# EasyEDA Pro project ProPrj_STM32G474RET6_2026-01-30.epro, board PCB4
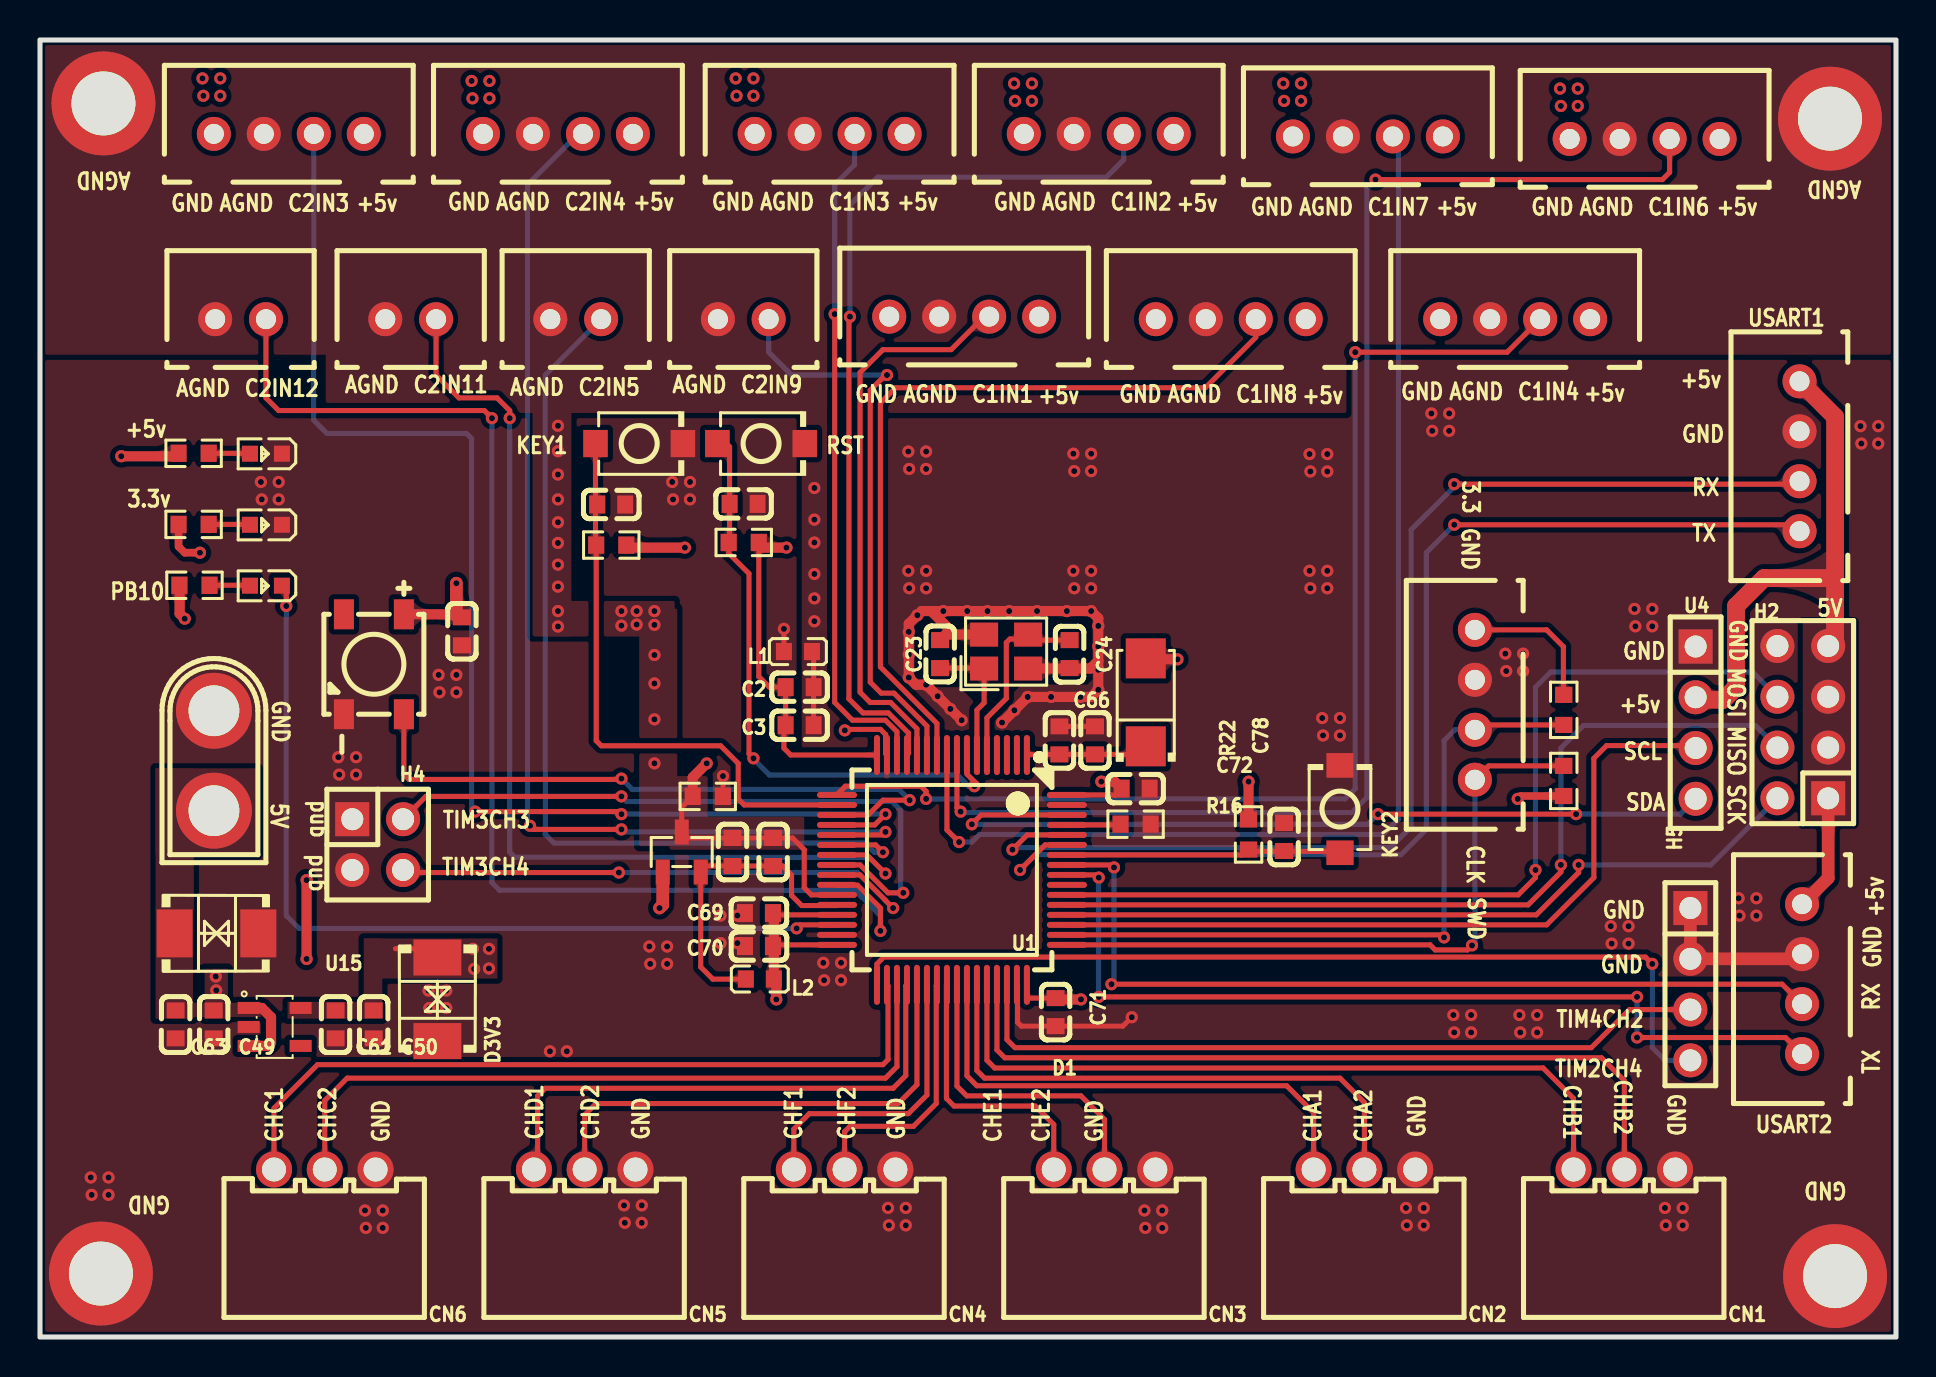
[diagram p4: board, top side]
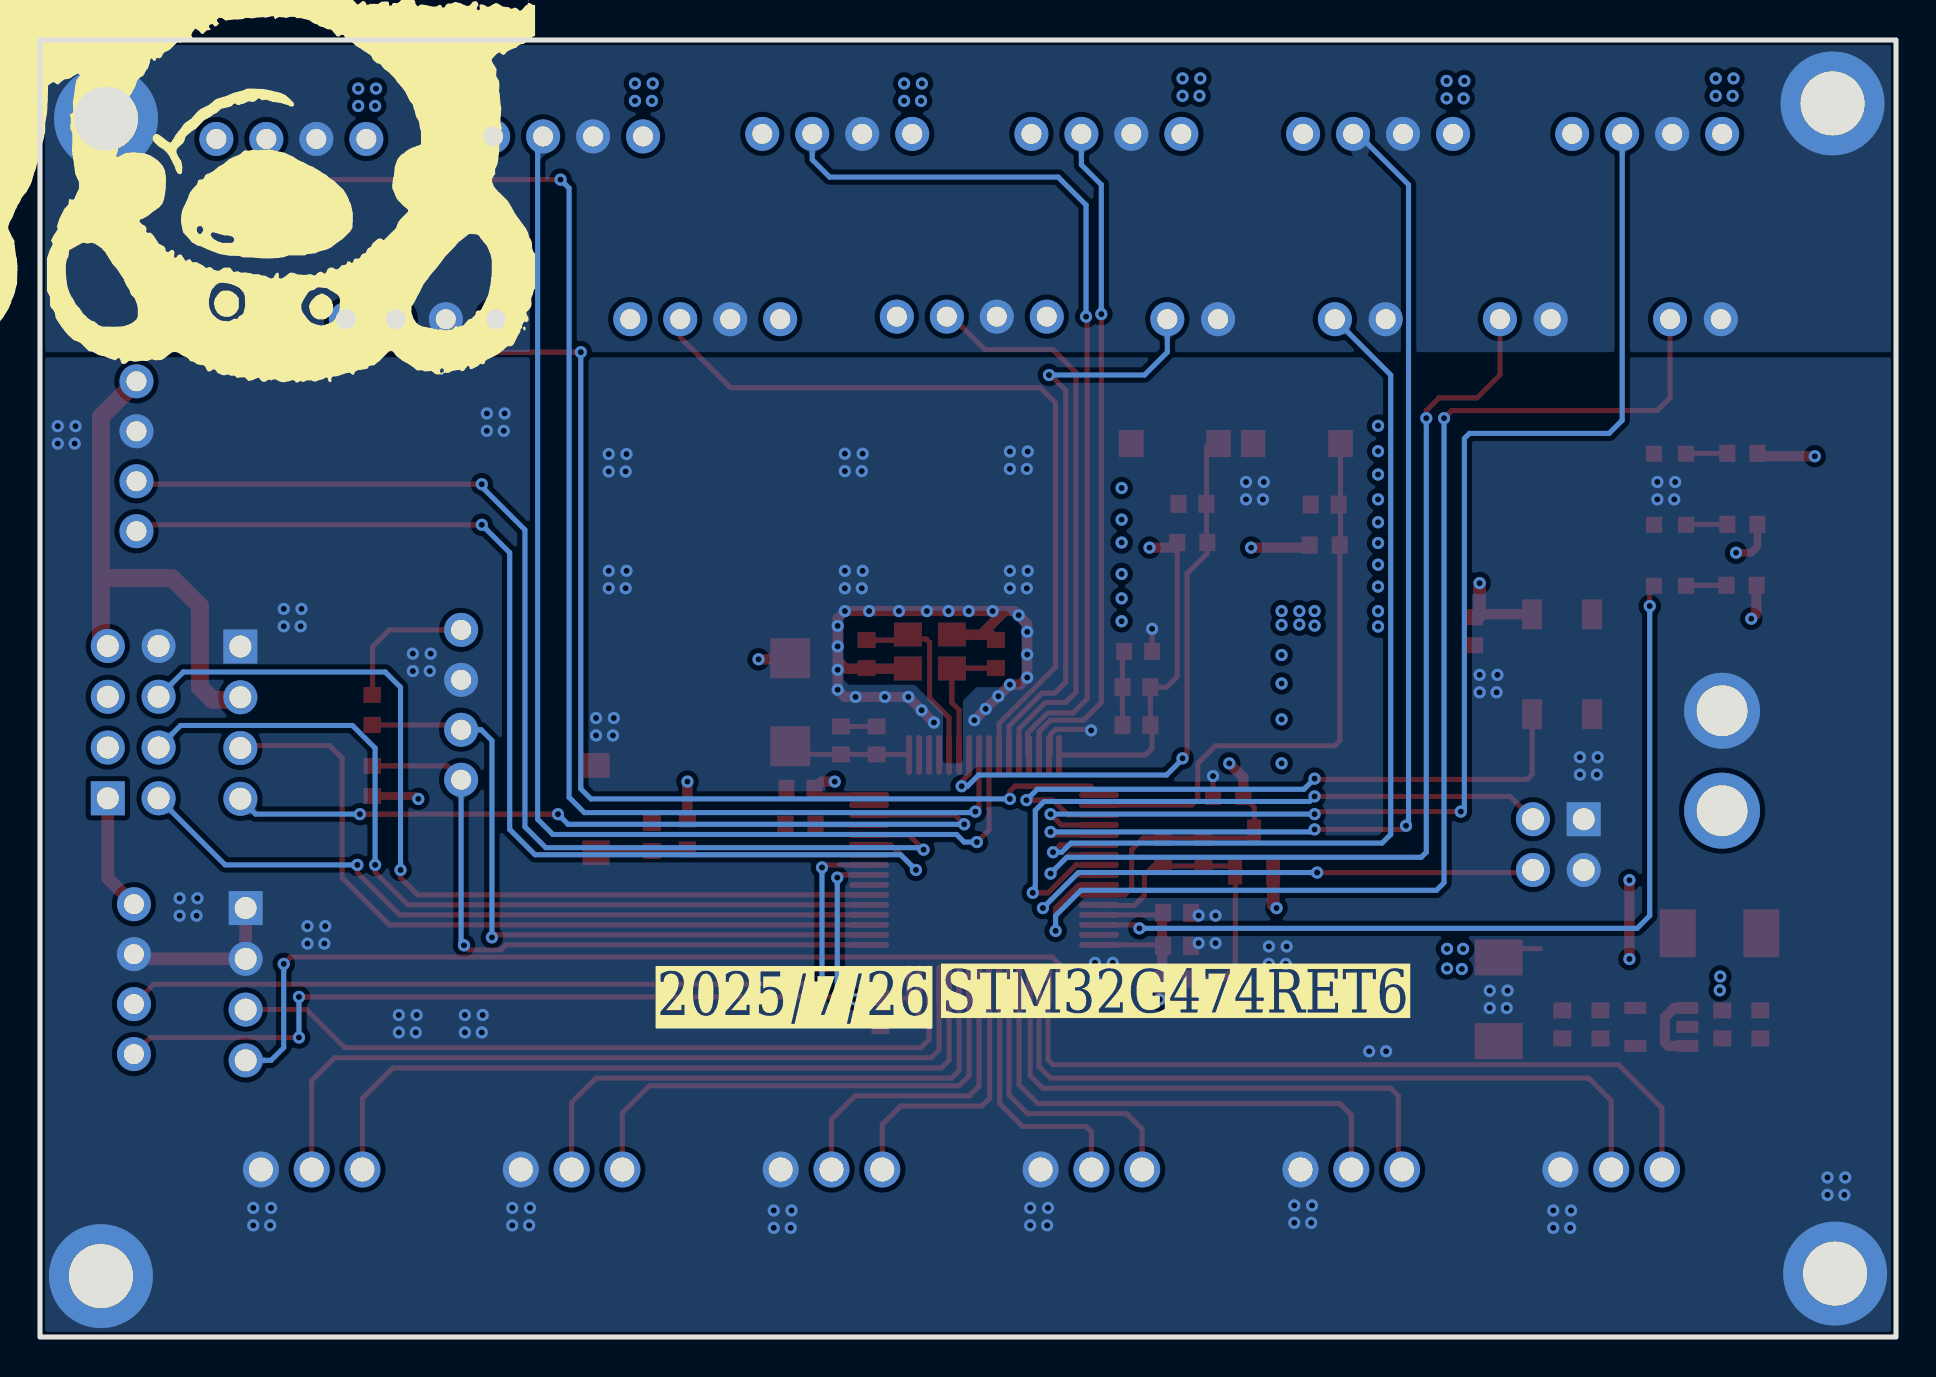
[diagram p5: board, bottom side, seen from below]

Outline 92.84 x 64.9 mm; copper layers: Top Layer, Inner1, Inner2, Bottom Layer. Coordinates in mm from the lower left corner of the outline.
Outline path: rectangle 0,64.9 92.84,0
Stack: Top Layer 0.035mm 外层铜厚1oz / Dielectric1 0.2104mm 7628 RC49% 8.6mil / Inner1 0.0152mm 内层铜厚 / Dielectric2 1.065mm 1.1mm H/HOZ Copper / Inner2 0.0152mm 内层铜厚 / Dielectric3 0.2104mm 7628 RC49% 8.6mil / Bottom Layer 0.035mm 外层铜厚1oz

## Design rules (mm)
template: 自定义配置
spacing copperThickness1oz (default): track to track 0.102, other pairs 0.152 to 0.3
spacing copperThickness2oz: track to track 0.203, other pairs 0.152 to 0.3
track width copperThickness1oz (default): min 0.127, default 0.254, max 2.54
track width copperThickness2oz: min 0.203, default 0.254, max 2.54
differential pair differentialPair (default): width min 0.127, default 0.254, max 2.54; gap min 0.152, default 0.152
via viaSize (default): diameter min 0.5, default 0.61, max 10; hole min 0.3, default 0.305, max 6.3

## Placement (name value [footprint] x y rotation side)
C2  10uF  [C0603]  37.99 32.52 180 top
C3  100nF  [C0603]  37.99 30.61 180 top
C23  12pF  [C0603]  45.02 34.17 270 top
C24  12pF  [C0603]  51.5 34.17 90 top
C44  100nF  [C0603]  21.1 35.31 270 top
C49  100nF  [C0603]  8.69 15.64 90 top
C50  100nF  [C0603]  16.69 15.64 90 top
C61  1uF  [C0603]  14.79 15.64 90 top
C63  1uF  [C0603]  6.79 15.64 90 top
C65  100nF  [C0603]  50.99 29.85 270 top
C66  100nF  [C0603]  52.77 29.85 270 top
C69  100nF  [C0603]  35.96 21.21 0 top
C70  100nF  [C0603]  35.96 19.56 0 top
C71  100nF  [C0603]  50.8 16.26 90 top
C72  100nF  [C0603]  54.8 27.44 180 top
C73  1uF  [C0603]  36.67 24.27 270 top
C74  10nF  [C0603]  34.64 24.27 270 top
C78  100nF  [C0603]  62.23 25.02 270 top
C80  100nF  [C0603]  35.19 41.69 180 top
C81  100nF  [C0603]  28.58 41.66 180 top
CN1  XH-3AW  [CONN-TH_3P-P2.54_HCTL_XH-3AW]  79.25 8.38 180 top
CN2  XH-3AW  [CONN-TH_3P-P2.54_HCTL_XH-3AW]  66.25 8.38 180 top
CN3  XH-3AW  [CONN-TH_3P-P2.54_HCTL_XH-3AW]  53.25 8.38 180 top
CN4  XH-3AW  [CONN-TH_3P-P2.54_HCTL_XH-3AW]  40.25 8.38 180 top
CN5  XH-3AW  [CONN-TH_3P-P2.54_HCTL_XH-3AW]  27.25 8.38 180 top
CN6  XH-3AW  [CONN-TH_3P-P2.54_HCTL_XH-3AW]  14.25 8.38 180 top
CN8  XT30U-M  [CONN-TH_XT30U-M]  8.7 28.83 90 top
CN11  B2B-XH-A(LF)(SN)  [CONN-TH_B2B-XH-A-LF-SN]  26.8 50.93 0 top
CN12  B2B-XH-A(LF)(SN)  [CONN-TH_B2B-XH-A-LF-SN]  35.18 50.93 0 top
CN13  B2B-XH-A(LF)(SN)  [CONN-TH_B2B-XH-A-LF-SN]  18.54 50.93 0 top
CN14  B2B-XH-A(LF)(SN)  [CONN-TH_B2B-XH-A-LF-SN]  10.03 50.93 0 top
D1  SS34-A  [SMA_L4.3-W2.6-LS5.2-RD]  55.31 31.76 90 top
D3V3  SMBJ3.3CA  [SMB_L4.6-W3.5-LS5.3-BI]  19.88 16.9 90 top
D3V4  SMBJ3.3CA  [SMB_L4.6-W3.5-LS5.3-BI]  8.83 20.2 180 top
H2  PZ254V-12-8P  [HDR-TH_8P-P2.54-V-M-R2-C4-S2.54]  88.17 30.76 90 top
H4  PZ254V-12-4P  [HDR-TH_4P-P2.54-V-M-R2-C2-S2.54]  16.89 24.64 270 top
H5  PZ254V-11-04P  [HDR-TH_4P-P2.54-V-M]  82.55 17.65 270 top
KEY2  SKRKAEE020  [SW-SMD_L3.9-W3.0-P4.45]  65.02 26.42 90 top
KEY3  SKRKAEE020  [SW-SMD_L3.9-W3.0-P4.45]  29.97 44.7 0 top
L1  BLM18PG121SN1D  [L0603]  37.91 34.3 0 top
L2  BLM18PG121SN1D  [L0603]  36.01 17.91 180 top
LED3  XL-5050RGBC-WS2812B  [LED-SMD_4P-L5.0-W5.0-BL_XL-5050RGBC]  16.7 33.66 180 top
LED4  LTST-C190YKT  [LED0603-RD]  11.3 40.64 180 top
LED5  LTST-C190YKT  [LED0603-RD]  11.3 44.2 180 top
LED6  LTST-C190YKT  [LED0603-RD]  11.3 37.59 180 top
NOREF  -  [Pad_e5011]  89.79 3.05 0 top
NOREF#2  -  [Pad_e5012]  3.05 3.17 0 top
NOREF#3  -  [Pad_e5014]  89.53 60.96 0 top
NOREF#4  -  [Pad_e5013]  3.17 61.72 0 top
R16  10kΩ  [R0603]  54.8 25.66 0 top
R17  1kΩ  [R0603]  7.68 40.66 0 top
R18  1kΩ  [R0603]  7.73 37.61 0 top
R19  5kΩ  [R0603]  7.68 44.22 0 top
R20  1kΩ  [R0603]  35.2 39.75 180 top
R22  1kΩ  [R0603]  60.45 25.15 270 top
R24  0Ω  [R0603]  33.4 27.05 180 top
R87  3.3kΩ  [R0603]  76.22 27.82 270 top
R88  3.3kΩ  [R0603]  76.22 31.38 90 top
R89  1kΩ  [R0603]  28.58 39.62 180 top
SW1  SKRKAEE020  [SW-SMD_L3.9-W3.0-P4.45]  36.07 44.7 0 top
U1  STM32G474RET6  [LQFP-64_L10.0-W10.0-P0.50-LS12.0-BL]  45.61 23.37 180 top
U4  HC-PZ254-11.5L-1x4PZ  [HDR-TH_4P-P2.54-V-M-4]  82.81 30.74 270 top
U15  LP5907MFX-3.3  [SOT-23-5_L3.0-W1.7-P0.95-LS2.8-BR]  11.74 15.52 180 top
U16  REF3033AIDBZRQ1  [SOT-23-3_L2.9-W1.3-P1.90-LS2.4-BR]  32.1 24.27 270 top
U24  B4B-XH-A(LF)(SN)  [CONN-TH_B4B-XH-A-LF-SN]  46.23 51.05 0 top
U25  B4B-XH-A(LF)(SN)  [CONN-TH_B4B-XH-A-LF-SN]  52.96 60.2 0 top
U26  B4B-XH-A(LF)(SN)  [CONN-TH_B4B-XH-A-LF-SN]  39.5 60.2 0 top
U27  B4B-XH-A(LF)(SN)  [CONN-TH_B4B-XH-A-LF-SN]  73.79 50.93 0 top
U28  B4B-XH-A(LF)(SN)  [CONN-TH_B4B-XH-A-LF-SN]  80.26 59.94 0 top
U29  B4B-XH-A(LF)(SN)  [CONN-TH_B4B-XH-A-LF-SN]  66.42 60.07 0 top
U30  B4B-XH-A(LF)(SN)  [CONN-TH_B4B-XH-A-LF-SN]  59.56 50.93 0 top
U31  B4B-XH-A(LF)(SN)  [CONN-TH_B4B-XH-A-LF-SN]  12.45 60.2 0 top
U32  B4B-XH-A(LF)(SN)  [CONN-TH_B4B-XH-A-LF-SN]  25.91 60.2 0 top
U34  B4B-XH-A(LF)(SN)  [CONN-TH_B4B-XH-A-LF-SN]  71.77 31.63 90 top
U35  B4B-XH-A(LF)(SN)  [CONN-TH_B4B-XH-A-LF-SN]  88.14 17.91 90 top
U36  B4B-XH-A(LF)(SN)  [CONN-TH_B4B-XH-A-LF-SN]  88.01 44.07 90 top
X1  12MHz  [CRYSTAL-SMD_4P-L3.2-W2.5-BL]  48.33 34.3 0 top

## Footprints (pads in the part's own frame, mm; a bottom-side part is the same pattern mirrored in y, then rotated)
C0603
  rect 0.8x0.9 smd: 1(-0.7,0) 2(0.7,0)
CONN-TH_3P-P2.54_HCTL_XH-3AW
  round 1.8 hole 1.199: 1(-2.54,0) 2(0.002,0) 3(2.54,0)
CONN-TH_B2B-XH-A-LF-SN
  round 1.7 hole 1: 1(1.27,0) 2(-1.27,0)
CONN-TH_B4B-XH-A-LF-SN
  round 1.7 hole 1: 1(3.75,0) 2(1.25,0) 3(-1.25,0) 4(-3.75,0)
CONN-TH_XT30U-M
  round 3.8 hole 2.54: 1(-2.5,0) 2(2.5,0)
CRYSTAL-SMD_4P-L3.2-W2.5-BL
  rect 1.4x1.2 smd: 1(-1.1,-0.85) 2(1.1,-0.85) 3(1.1,0.85) 4(-1.1,0.85)
HDR-TH_4P-P2.54-V-M
  rect 1.7x1.7 hole 1.1: 1(-3.81,0)
  round 1.7 hole 1.1: 2(-1.27,0) 3(1.27,0) 4(3.81,0)
HDR-TH_4P-P2.54-V-M-4
  rect 1.7x1.7 hole 1.1: 1(-3.81,0)
  round 1.7 hole 1.1: 2(-1.27,0) 3(1.27,0) 4(3.81,0)
HDR-TH_4P-P2.54-V-M-R2-C2-S2.54
  rect 1.7x1.7 hole 1.1: 1(-1.27,-1.27)
  round 1.7 hole 1.1: 2(-1.27,1.27) 3(1.27,-1.27) 4(1.27,1.27)
HDR-TH_8P-P2.54-V-M-R2-C4-S2.54
  rect 1.7x1.7 hole 1.1: 1(-3.81,-1.27)
  round 1.7 hole 1.1: 2(-3.81,1.27) 3(-1.27,-1.27) 4(-1.27,1.27) 5(1.27,-1.27) 6(1.27,1.27) 7(3.81,-1.27) 8(3.81,1.27)
L0603
  rect 0.8x0.864 smd: 1(-0.7,0) 2(0.7,0)
LED0603-RD
  rect 0.8x0.8 smd: 1(-0.799,0) 2(0.799,0)
LED-SMD_4P-L5.0-W5.0-BL_XL-5050RGBC
  rect 1x1.5 smd: 1(-1.5,-2.5) 2(1.5,-2.5) 3(1.5,2.5) 4(-1.5,2.5)
LQFP-64_L10.0-W10.0-P0.50-LS12.0-BL
  oval 0.3x2 smd: 1(-3.75,-5.75) 2(-3.25,-5.75) 3(-2.75,-5.75) 4(-2.25,-5.75) 5(-1.75,-5.75) 6(-1.25,-5.75) 7(-0.75,-5.75) 8(-0.25,-5.75) 9(0.25,-5.75) 10(0.75,-5.75) 11(1.25,-5.75) 12(1.75,-5.75) 13(2.25,-5.75) 14(2.75,-5.75) 15(3.25,-5.75) 16(3.75,-5.75) 33(3.75,5.75) 34(3.25,5.75) 35(2.75,5.75) 36(2.25,5.75) 37(1.75,5.75) 38(1.25,5.75) 39(0.75,5.75) 40(0.25,5.75) 41(-0.25,5.75) 42(-0.75,5.75) 43(-1.25,5.75) 44(-1.75,5.75) 45(-2.25,5.75) 46(-2.75,5.75) 47(-3.25,5.75) 48(-3.75,5.75)
  oval 2x0.3 smd: 17(5.75,-3.75) 18(5.75,-3.25) 19(5.75,-2.75) 20(5.75,-2.25) 21(5.75,-1.75) 22(5.75,-1.25) 23(5.75,-0.75) 24(5.75,-0.25) 25(5.75,0.25) 26(5.75,0.75) 27(5.75,1.25) 28(5.75,1.75) 29(5.75,2.25) 30(5.75,2.75) 31(5.75,3.25) 32(5.75,3.75) 49(-5.75,3.75) 50(-5.75,3.25) 51(-5.75,2.75) 52(-5.75,2.25) 53(-5.75,1.75) 54(-5.75,1.25) 55(-5.75,0.75) 56(-5.75,0.25) 57(-5.75,-0.25) 58(-5.75,-0.75) 59(-5.75,-1.25) 60(-5.75,-1.75) 61(-5.75,-2.25) 62(-5.75,-2.75) 63(-5.75,-3.25) 64(-5.75,-3.75)
Pad_e5011
  round 5.2 hole 3.2: 1(0,0)
Pad_e5012
  round 5.2 hole 3.2: 1(0,0)
Pad_e5013
  round 5.2 hole 3.2: 1(0,0)
Pad_e5014
  round 5.2 hole 3.2: 1(0,0)
R0603
  rect 0.806x0.864 smd: 1(-0.753,0) 2(0.753,0)
SMA_L4.3-W2.6-LS5.2-RD
  rect 2x2 smd: 1(-2.2,0) 2(2.2,0)
SMB_L4.6-W3.5-LS5.3-BI
  rect 1.8x2.4 smd: 1(-2.091,0) 2(2.091,0)
SOT-23-3_L2.9-W1.3-P1.90-LS2.4-BR
  rect 1.25x0.7 smd: 1(1,-0.95) 2(1,0.95) 3(-1,0)
SOT-23-5_L3.0-W1.7-P0.95-LS2.8-BR
  rect 1.1x0.6 smd: 1(1.3,-0.95) 2(1.3,0) 3(1.3,0.95) 4(-1.3,0.95) 5(-1.3,-0.95)
SW-SMD_L3.9-W3.0-P4.45
  rect 1.23x1.36 smd: 1(-2.185,0) 2(2.185,0)

## Nets
As in the schematic, except:
AGND: C2.1 C3.1 C73.1 C74.1 CN11.2 CN12.2 CN13.2 CN14.2 L1.2 NOREF#3.1 NOREF#4.1 R24.2 U1.27 U16.3 U24.3 U25.3 U26.3 U27.3 U28.3 U29.3 U30.3 U31.3 U32.3
GND: C23.1 C24.1 C44.2 C49.1 C50.1 C61.1 C63.1 C65.1 C66.1 C69.1 C70.1 C71.1 C72.1 C78.1 C80.1 C81.1 CN1.1 CN2.1 CN3.1 CN4.1 CN5.1 CN6.1 CN8.2 D3V3.1 D3V4.1 H2.8 H4.1 H4.3 H5.1 H5.2 KEY2.2 KEY3.2 L1.1 LED3.3 LED4.1 LED5.1 NOREF.1 NOREF#2.1 R16.2 R24.1 SW1.2 U1.15 U1.31 U1.47 U1.63 U4.1 U15.2 U24.4 U25.4 U26.4 U27.4 U28.4 U29.4 U30.4 U31.4 U32.4 U34.2 U35.2 U36.2 X1.2 X1.4

Pads without a net: LED3 2; U15 4

## Via types
v1: diameter 0.61, hole 0.305, Top Layer to Bottom Layer, 270 vias

## Routing (per net, layer and track width the routed paths; a pad name or vN(x,y) marks a point on that pad's centre or on a via; arc(x,y) is an arc through that point)
3.3V: length 237.6
  Top Layer w0.254: U34.1 75.36,35.38 76.2,34.54 76.2,32.15 R88.2 ; U1.48 49.37,16.96 C71.2 ; U1.16 37.55,29.12 37.21,29.46 37.21,30.53 C3.2 C2.2 36.48,32.52 35.95,33.04 R20.1 ; C69.2 36.71,21.17 36.75,21.12 U1.29 ; D3V3.2 19.43,19.43 17.78,19.43 ; 36.71,19.56 36.77,19.62 U1.32 ; C72.2 53.79,27.12 U1.64
  Top Layer w0.381: R87.2 74.06,27.07 v1(73.91,26.92) ; v1(8,39.24) 7.24,39.24 6.93,39.55 R17.1
  Top Layer w0.508: C70.2 36.71,19.52 L2.1 36.83,17.79 v1(36.83,16.89) ; 29.34,39.62 29.46,39.5 v1(32.26,39.5) ; v1(56.9,33.91) 55.36,33.91 D1.2 ; C71.2 50.86,16.89 v1(52.07,16.89) ; v1(53.09,27.79) 53.75,27.79 C72.2 ; v1(60.45,27.79) R22.1 ; v1(7.24,35.94) 6.98,36.19 6.98,37.46 ; v1(37.34,39.5) 36.07,39.5 35.94,39.62 ; v1(13.33,18.91) v1(13.33,22.86) ; 36.71,21.17 36.71,19.56
  Inner2 w0.508: 68.71,27.79 68.71,34.67 ; 68.71,27.79 68.71,25.41 ; 68.71,27.79 v1(60.45,27.79) v1(53.09,27.79) ; 68.71,34.67 69.42,35.38 U34.1 ; 68.71,34.67 67.95,33.91 v1(56.9,33.91) ; 51.56,15.24 52.07,15.75 v1(52.07,16.89) ; 51.56,15.24 36.75,15.24 ; 51.56,15.24 66.93,15.24 68.71,17.02 68.71,25.41 ; v1(36.83,16.89) 36.83,15.32 36.75,15.24 ; 13.33,35.62 7.56,35.62 v1(7.24,35.94) ; 13.33,35.62 v1(13.33,22.86) ; 13.33,35.62 13.33,38.86 12.95,39.24 v1(8,39.24) ; 68.71,25.41 73.29,25.41 73.91,26.03 v1(73.91,26.92) ; 36.75,15.24 32.26,15.24 ; 21.65,18.91 v1(13.33,18.91) ; 21.65,18.91 v1(21.65,19.42) ; 21.65,18.91 21.65,15.94 22.35,15.24 32.26,15.24 ; 32.26,15.24 v1(32.26,39.5) v1(37.34,39.5)
  vias: v1(21.72,18.41) v1(22.46,19.42) v1(22.46,18.44)
+5V: length 250.6
  Top Layer w0.254: 20.95,36.16 C44.1
  Top Layer w0.508: v1(4.06,44.07) 6.78,44.07 R19.1 ; U15.1 11.09,16.47 11.56,16 11.56,14.73 11.39,14.57 U15.3 ; LED3.1 20.83,36.16
  Top Layer w0.635: v1(30.99,21.46) 31.15,21.62 U16.1 ; v1(20.83,37.72) 20.83,36.07 ; H2.1 89.45,22.96 U35.1
  Top Layer w0.889: U4.2 82.94,31.88 84.21,31.88 84.84,32.51 84.84,36.58 86.23,37.97 89.79,37.97 ; U36.1 89.79,46.04 89.79,37.97 ; 89.79,37.97 89.79,34.92 H2.7
  Inner2 w0.635: 23.18,21.46 v1(30.99,21.46) ; 23.18,21.46 10.29,21.46 8.79,19.97 v1(8.79,18.04) ; 23.18,21.46 23.18,36.63 22.1,37.72 v1(20.83,37.72)
  Inner2 w1.27: CN8.1 5.33,26.33 4.06,27.6 v1(4.06,44.07) 4.06,54.86 5.84,56.64 16.37,56.64 ; U32.1 29.66,56.7 29.6,56.64 ; 29.6,56.64 49.65,56.64 ; 29.6,56.64 16.37,56.64 ; 49.65,56.64 49.98,56.31 U24.1 ; 49.65,56.64 63.31,56.64 ; 16.37,56.64 16.37,60.03 U31.1 ; U27.1 77.47,50.99 77.47,56.13 ; 70.05,56.64 70.17,56.76 U29.1 ; 70.05,56.64 82.72,56.64 ; 70.05,56.64 63.31,56.64 ; U25.1 56.9,60.01 56.9,56.9 ; 63.31,56.64 U30.1 ; U26.1 43.25,57.09 43.18,57.02 ; 82.72,56.64 86.61,56.64 88.01,55.24 U36.1 ; 82.72,56.64 84.01,57.94 U28.1
  vias: v1(8.82,17.35)
AGND: length 17.9
  Top Layer w0.254: L1.2 38.7,34.21 C2.1 C3.1 ; R24.2 32.1,26.5 U16.3 32.4,24.97 C74.1 C73.1 37.64,24.97 38.23,24.38 38.23,22.48 38.58,22.12 U1.27
  Top Layer w0.508: v1(33.35,28.7) 32.65,28 R24.2
  vias: v1(25.91,45.59) v1(25.91,44.32) v1(25.91,43.15) v1(25.91,41.91) v1(25.91,40.77) v1(25.91,39.73) v1(25.91,38.64) v1(25.91,37.55) v1(25.91,36.32) v1(25.91,35.55) v1(29.08,36.32) v1(29.08,35.6) v1(29.84,36.32) v1(29.84,35.65) v1(30.73,36.32) v1(30.73,35.63) v1(30.73,34.12) v1(30.73,32.7) v1(30.73,30.91) v1(30.73,28.7) v1(38.73,42.48) v1(38.73,40.9) v1(38.73,39.75) v1(38.73,38.18) v1(38.73,36.96) v1(38.73,35.81)
GND: length 213.9
  Top Layer w0.254: U1.15 42.29,29.19 42.29,30.15 42.04,30.4 40.31,30.4 v1(40.26,30.35) ; C66.1 C65.1 ; v1(54.61,16) 54.16,15.56 C71.1 49.09,15.56 48.89,15.75 48.89,17.59 U1.47 ; v1(34.16,28.07) 34.16,27.06 R24.1 ; L1.1 v1(37.21,35.43)
  Top Layer w0.508: 45.76,35.15 45.3,35.15 C23.1 ; 45.76,35.15 44.58,36.32 ; 45.76,35.15 X1.4 ; v1(48.12,30.74) v1(48.74,31.36) v1(49.4,32.03) v1(50.58,32.03) v1(52.04,32.03) 52.58,32.03 v1(52.94,32.38) v1(52.94,33.38) 52.94,33.84 ; v1(46.1,30.86) v1(45.53,31.43) v1(44.9,32.06) v1(44.32,32.64) 43.81,32.64 v1(43.46,33) v1(43.46,34.15) v1(43.46,35.28) 43.46,35.69 44.09,36.32 44.58,36.32 ; X1.2 52.54,33.45 52.94,33.84 ; 52.94,33.84 v1(52.94,34.56) v1(52.94,35.58) 52.94,35.96 v1(52.58,36.32) v1(51.36,36.32) v1(49.87,36.32) v1(48.48,36.32) v1(47.39,36.32) v1(46.38,36.32) v1(45.18,36.32) 44.58,36.32
  Top Layer w0.635: H5.1 H5.2 87.9,18.92 U35.2
  Inner1 w1.016: 22.25,54.36 22.25,60.1 U32.4 ; 22.25,54.36 8.85,54.36 ; 22.25,54.36 35.66,54.36 ; 42.48,54.36 U24.4 ; 42.48,54.36 35.66,54.36 ; 42.48,54.36 49.16,54.36 ; 49.16,54.36 49.16,60.15 U25.4 ; 49.16,54.36 55.81,54.36 ; 55.81,54.36 U30.4 ; 55.81,54.36 70.1,54.36 ; U36.2 86.84,45.32 85.85,46.31 85.85,51.56 83.06,54.36 76.28,54.36 ; 35.66,54.36 35.66,60.11 U26.4 ; 8.85,54.36 7.56,54.36 6.1,52.9 6.1,32.35 7.11,31.33 CN8.2 ; 8.85,54.36 8.85,60.05 U31.4 ; 76.28,54.36 76.51,54.59 U28.4 ; 76.28,54.36 70.1,54.36 ; 70.1,54.36 70.1,50.99 U27.4 ; U29.4 62.61,60.01 62.61,54.61
  vias: v1(2.54,7.98) v1(2.58,7.11) v1(3.43,7.98) v1(3.43,7.11) v1(8.13,62.97) v1(8.17,62.1) v1(9.02,62.97) v1(9.02,62.1) v1(11.05,42.78) v1(11.09,41.91) v1(11.94,42.78) v1(11.94,41.91) v1(14.92,29.01) v1(14.97,28.14) v1(15.81,29.01) v1(15.81,28.14) v1(16.26,6.33) v1(16.3,5.46) v1(17.14,6.33) v1(17.14,5.46) v1(19.43,17.33) v1(19.48,16.46) v1(19.94,33.13) v1(19.98,32.26) v1(20.32,17.33) v1(20.32,16.46) v1(20.83,33.13) v1(20.83,32.26) v1(21.59,62.85) v1(21.63,61.98) v1(22.48,62.85) v1(22.48,61.98) v1(25.51,14.3) v1(26.35,14.3) v1(29.21,6.59) v1(29.25,5.72) v1(30.1,6.59) v1(30.1,5.72) v1(30.48,19.54) v1(30.52,18.67) v1(31.37,19.54) v1(31.37,18.67) v1(31.62,42.78) v1(31.67,41.91) v1(32.51,42.78) v1(32.51,41.91) v1(34.04,21.09) v1(34.04,19.71) v1(34.8,62.97) v1(34.84,62.1) v1(34.88,21.09) v1(34.88,19.71) v1(35.69,62.97) v1(35.69,62.1) v1(39.18,18.72) v1(39.22,17.85) v1(40.07,18.72) v1(40.07,17.85) v1(42.42,6.46) v1(42.46,5.59) v1(43.31,6.46) v1(43.31,5.59) v1(43.43,44.31) v1(43.43,38.34) v1(43.48,43.43) v1(43.48,37.46) v1(43.88,36.11) v1(44.32,44.31) v1(44.32,43.43) v1(44.32,38.34) v1(44.32,37.46) v1(48.73,62.72) v1(48.77,61.85) v1(49.61,62.72) v1(49.61,61.85) v1(51.69,44.2) v1(51.73,43.32) v1(51.69,38.34) v1(51.73,37.46) v1(52.58,44.2) v1(52.58,43.32) v1(52.58,38.34) v1(52.58,37.46) v1(55.24,6.33) v1(55.29,5.46) v1(56.13,6.33) v1(56.13,5.46) v1(62.19,62.72) v1(62.23,61.85) v1(63.08,62.72) v1(63.08,61.85) v1(63.5,44.18) v1(63.54,43.31) v1(63.5,38.34) v1(63.54,37.46) v1(64.14,30.97) v1(64.18,30.1) v1(64.39,44.18) v1(64.39,43.31) v1(64.39,38.34) v1(64.39,37.46) v1(65.02,30.97) v1(65.02,30.1) v1(68.33,6.46) v1(68.37,5.59) v1(69.21,6.46) v1(69.21,5.59) v1(69.6,46.21) v1(69.64,45.34) v1(70.48,46.21) v1(70.48,45.34) v1(70.7,16.11) v1(70.74,15.24) v1(71.58,16.11) v1(71.58,15.24) v1(73.3,34.19) v1(73.34,33.32) v1(74,16.11) v1(74.04,15.24) v1(74.19,34.19) v1(74.19,33.32) v1(74.89,16.11) v1(74.89,15.24) v1(76.03,62.47) v1(76.07,61.59) v1(76.92,62.47) v1(76.92,61.59) v1(78.57,20.56) v1(78.61,19.68) v1(79.46,20.56) v1(79.46,19.68) v1(79.76,36.43) v1(79.8,35.56) v1(80.64,36.43) v1(80.64,35.56) v1(81.28,6.46) v1(81.32,5.59) v1(82.17,6.46) v1(82.17,5.59) v1(84.96,21.95) v1(85.01,21.08) v1(85.85,21.95) v1(85.85,21.08) v1(91.06,45.58) v1(91.1,44.7) v1(91.95,45.58) v1(91.95,44.7)
VBAT: length 6.1
  Top Layer w0.254: D1.1 54.9,29.15 C66.2 C65.2 49.39,29.15 U1.1
ADC1_IN1: length 28.5
  Top Layer w0.254: U24.2 47.22,51.05 45.57,49.4 42.16,49.4 41.02,48.26 41.02,32.26 41.53,31.75 42.55,31.75 43.86,30.43 U1.12
ADC1_IN2: length 45.5
  Top Layer w0.254: v1(40.51,51.05) 40.46,51 40.46,31.93 41.16,31.23 42.43,31.23 43.44,30.22 43.44,29.19 U1.13
  Bottom Layer w0.254: U25.2 54.21,58.91 53.34,58.04 41.91,58.04 40.51,56.64 v1(40.51,51.05)
ADC1_IN3: length 33.7
  Top Layer w0.254: v1(39.75,51.18) 39.75,31.75 40.64,30.86 42.29,30.86 42.86,30.29 U1.14
  Bottom Layer w0.254: v1(39.75,51.18) 39.75,57.66 40.75,58.65 U26.2
ADC1_IN4: length 58.6
  Top Layer w0.254: v1(44.32,26.92) 44.32,27.3 44.07,27.56 40.28,27.56 39.87,27.14 U1.17 ; v1(65.79,49.28) 73.39,49.28 U27.2
  Bottom Layer w0.254: v1(65.79,49.28) 65.79,27.43 65.28,26.92 v1(44.32,26.92)
ADC1_IN6: length 71.2
  Top Layer w0.254: v1(46.05,26.29) 45.86,26.47 U1.8 ; v1(66.8,57.91) 81.15,57.91 81.51,58.27 U28.2
  Bottom Layer w0.254: v1(66.8,57.91) 66.37,57.48 66.37,27 65.61,26.24 46.1,26.24 v1(46.05,26.29)
ADC1_IN7: length 61.3
  Top Layer w0.254: U1.9 45.37,25.37 v1(45.97,24.76)
  Bottom Layer w0.254: U29.2 67.95,59.8 67.95,25.91 67.18,25.15 46.99,25.15 46.61,24.76 v1(45.97,24.76)
ADC1_IN8: length 39.8
  Top Layer w0.254: U1.10 44.86,30.7 42.04,33.53 42.04,46.74 42.8,47.5 58.29,47.5 60.81,50.02 U30.2
ADC2_IN3: length 64.6
  Top Layer w0.254: v1(42.29,26.16) 41.75,25.62 U1.20 ; v1(21.77,26.29) 28.96,26.29 v1(29.08,26.16)
  Bottom Layer w0.254: v1(21.77,26.29) 21.59,26.47 21.59,44.96 21.34,45.21 14.35,45.21 13.7,45.87 U31.2 ; v1(29.08,26.16) v1(42.29,26.16)
ADC2_IN4: length 56.4
  Top Layer w0.254: v1(42.29,25.27) 42.14,25.12 U1.21 ; v1(24.51,25.58) 24.69,25.4 v1(29.08,25.4)
  Bottom Layer w0.254: v1(24.51,25.58) 24.38,25.7 24.38,57.66 26.92,60.2 U32.2 ; v1(42.29,25.27) 29.21,25.27 v1(29.08,25.4)
ADC2_IN5: length 46.6
  Top Layer w0.254: v1(42.16,24.26) 41.8,24.62 U1.22
  Bottom Layer w0.254: CN11.1 25.27,48.13 25.27,25.15 25.7,24.71 41.27,24.71 41.73,24.26 v1(42.16,24.26)
ADC2_IN9: length 28.9
  Top Layer w0.254: U1.11 44.37,30.56 42.71,32.22 42.08,32.22 41.53,32.77 41.53,47.37 42.29,48.13
  Bottom Layer w0.254: v1(42.37,48.13) 37.59,48.13 36.45,49.28 CN12.1
ADC2_IN11: length 51.4
  Top Layer w0.254: CN13.1 19.81,48.13 20.95,46.99 22.86,46.99 23.49,46.35 v1(23.49,45.97) ; v1(42.29,23.19) 41.36,24.12 U1.23
  Bottom Layer w0.254: v1(23.49,45.97) 23.49,24.26 23.75,24 41.48,24 v1(42.29,23.19)
ADC2_IN12: length 63.6
  Top Layer w0.254: CN14.1 11.3,46.99 11.94,46.35 22.22,46.35 v1(22.61,45.97) ; v1(42.04,20.32) 42.04,21.46 40.89,22.61 39.88,22.61 U1.26
  Bottom Layer w0.254: v1(42.04,20.32) 42.04,21.08 40.77,22.35 22.99,22.35 22.61,22.73 v1(22.61,45.97)
HRTIM1_CHA1: length 25.5
  Top Layer w0.254: U1.42 46.37,13.07 46.86,12.57 62.36,12.57 63.71,11.22 CN2.3
HRTIM1_CHA2: length 27.7
  Top Layer w0.254: U1.43 46.86,17.62 46.86,13.33 47.24,12.95 65.02,12.95 66.25,11.73 CN2.2
HRTIM1_CHB1: length 37.5
  Top Layer w0.254: CN1.3 76.71,11.94 75.18,13.46 47.75,13.46 47.37,13.85 U1.44
HRTIM1_CHB2: length 39.7
  Top Layer w0.254: CN1.2 79.25,12.83 78.11,13.97 48.26,13.97 47.86,14.36 U1.45
HRTIM1_CHC1: length 38.6
  Top Layer w0.254: U1.34 42.42,17.57 42.42,13.88 42.16,13.63 13.88,13.63 11.71,11.45 CN6.3
HRTIM1_CHC2: length 36.9
  Top Layer w0.254: 14.24,8.38 14.24,11.83 15.37,12.95 42.29,12.95 42.86,13.53 U1.35
HRTIM1_CHD1: length 27.2
  Top Layer w0.254: U1.36 43.31,17.56 43.31,13.08 42.67,12.45 25.27,12.45 24.89,12.06 24.89,8.57 CN5.3
HRTIM1_CHD2: length 25
  Top Layer w0.254: CN5.2 27.25,11.12 27.81,11.68 42.93,11.68 43.86,12.62 U1.37
HRTIM1_CHE1: length 13.9
  Top Layer w0.254: CN3.3 50.71,10.63 49.78,11.56 45.72,11.56 45.34,11.94 45.34,17.6 U1.40
HRTIM1_CHE2: length 15.6
  Top Layer w0.254: CN3.2 53.25,10.89 52.07,12.06 46.36,12.06 45.86,12.55 U1.41
HRTIM1_CHF1: length 14.9
  Top Layer w0.254: CN4.3 37.71,10.4 38.48,11.18 43.43,11.18 44.37,12.11 U1.38
HRTIM1_CHF2: length 13
  Top Layer w0.254: CN4.2 40.25,10.27 40.51,10.54 43.69,10.54 44.83,11.68 44.83,17.59 U1.39
I2C1_SCL: length 38.7
  Top Layer w0.254: U4.3 82.69,29.59 78.36,29.59 77.72,28.96 77.72,22.99 75.36,20.62 U1.51
I2C1_SDA: length 41.7
  Top Layer w0.254: v1(46.61,25.65) 47.08,26.12 U1.62 ; v1(66.93,26.16) v1(76.83,26.16)
  Bottom Layer w0.254: v1(76.83,26.16) 82.05,26.16 U4.4 ; v1(46.61,25.65) 66.42,25.65 v1(66.93,26.16)
KEY1: length 29.3
  Top Layer w0.254: KEY3.1 27.79,39.66 R89.2 27.82,29.84 28.08,29.58 34.04,29.58 34.92,28.7 34.92,26.92 35.23,26.62 U1.18
KEY2: length 13.6
  Top Layer w0.254: U1.58 60.1,24.12 60.28,24.3 64.78,24.3 64.85,24.37
LED(TIM2CH3): length 44.5
  Top Layer w0.254: U1.30 38.02,20.62 v1(37.85,20.45) ; v1(12.32,36.58) 12.32,37.38 LED6.1
  Bottom Layer w0.254: v1(12.32,36.58) 12.32,21.08 12.95,20.45 v1(37.85,20.45)
PA5: length 32.8
  Top Layer w0.254: v1(29.08,27.94) 29.04,27.9 18.46,27.9 18.2,28.15 LED3.4 ; U1.19 41.42,26.12 42.16,26.86 v1(43.5,26.86)
  Bottom Layer w0.254: v1(43.5,26.86) 42.95,27.41 29.62,27.41 v1(29.08,27.94)
PA12: length 37.9
  Top Layer w0.254: U1.46 48.37,14.88 48.77,14.48 77.6,14.48 79.5,16.38 H5.3
PA13: length 33.5
  Top Layer w0.254: U1.49 69.53,19.62 69.79,19.37 71.4,19.37 v1(71.63,19.6) ; U34.4 72.47,28.58 R87.1
  Bottom Layer w0.254: v1(71.63,19.6) 71.77,19.74 U34.4
PA14: length 35.1
  Top Layer w0.254: v1(70.23,19.99) 70.1,20.12 U1.50 ; U34.3 72.02,30.63 R88.1
  Bottom Layer w0.254: U34.3 70.77,30.38 70.23,29.84 v1(70.23,19.99)
PB0: length 33.7
  Top Layer w0.254: 18.16,25.91 19.3,27.05 v1(29.08,27.05) ; v1(43.18,22.22) 42.42,22.22 41.02,23.62 U1.24
  Bottom Layer w0.254: v1(29.08,27.05) 29.34,26.8 42.61,26.8 43.05,26.35 43.05,22.35 v1(43.18,22.22)
PB1: length 28.8
  Top Layer w0.254: 18.16,23.37 18.29,23.24 v1(28.96,23.24) ; U1.25 41.02,23.12 42.27,21.87 42.27,21.86 v1(42.67,21.46)
  Bottom Layer w0.254: v1(42.67,21.46) 40.89,23.24 v1(28.96,23.24)
PB3: length 45.2
  Top Layer w0.254: v1(79.88,17.02) v1(52.96,17.02) ; U1.56 52.82,23.12 v1(52.96,22.99) ; U35.4 87.31,14.99 v1(79.88,14.99)
  Bottom Layer w0.254: v1(52.96,17.02) v1(52.96,22.99) ; v1(79.88,14.99) v1(79.88,17.02)
PB4: length 43.3
  Top Layer w0.254: v1(53.59,17.65) 87.14,17.65 U35.3 ; v1(53.72,23.49) 53.59,23.62 U1.57
  Bottom Layer w0.254: v1(53.72,23.49) 53.72,17.78 v1(53.59,17.65)
PB6: length 57.2
  Top Layer w0.254: U36.4 87.69,40.64 v1(70.74,40.64) ; v1(49.02,23.37) 50.28,24.62 U1.59
  Bottom Layer w0.254: v1(49.02,23.37) 49.78,24.13 68.07,24.13 69.34,25.4 69.34,39.24 v1(70.74,40.64)
PB7: length 58.8
  Top Layer w0.254: U1.60 49.38,25.12 v1(48.64,24.38) ; U36.3 87.86,42.67 v1(70.74,42.67)
  Bottom Layer w0.254: v1(48.64,24.38) 48.74,24.49 67.54,24.49 68.58,25.53 68.58,40.39 70.74,42.54 v1(70.74,42.67)
PB8_BOOT0: length 2.8
  Top Layer w0.254: 54.05,25.91 53.76,25.62 U1.61
PB11: length 46.5
  Top Layer w0.254: U1.33 41.86,18.67 42.21,19.01 80.3,19.01 v1(80.64,18.67)
  Bottom Layer w0.254: v1(80.64,18.67) 80.64,14.48 81.28,13.84 H5.4
PC10: length 38.2
  Top Layer w0.254: U1.52 74.84,21.12 76.96,23.24 v1(76.96,23.62)
  Bottom Layer w0.254: H2.2 83.57,23.62 v1(76.96,23.62)
PC11: length 43.3
  Top Layer w0.254: U1.53 74.43,21.62 76.07,23.26 v1(76.07,23.62)
  Bottom Layer w0.254: v1(76.07,23.62) 76.07,29.46 77.21,30.6 85.8,30.6 H2.4
PC12: length 46.3
  Top Layer w0.254: U1.54 73.94,22.12 74.8,22.99 v1(74.8,23.37)
  Bottom Layer w0.254: H2.6 85.67,33.27 75.56,33.27 74.8,32.51 v1(74.8,23.37)
PF0_OSC_IN: length 9.5
  Top Layer w0.254: C24.2 49.7,34.87 X1.3 49.2,34.92 48.51,34.92 48.33,34.75 48.33,31.95 47.37,30.98 U1.5
PF1_OSC_OUT: length 6.7
  Top Layer w0.254: U1.6 46.86,31.37 47.23,31.73 X1.1 47.2,33.47 C23.2
PG10_NRST: length 29.7
  Top Layer w0.254: v1(46.74,27.56) 46.74,27.79 46.37,28.16 U1.7 ; v1(35.69,28.96) 35.46,29.18 35.46,38.2 34.45,39.21 R20.2 34.49,39.8 C80.2 34.49,44.55 34.33,44.71
  Bottom Layer w0.254: v1(35.69,28.96) 35.69,28.92 36.49,28.12 45.88,28.12 46.45,27.56 v1(46.74,27.56)
VREF: length 15.6
  Top Layer w0.254: L2.2 35.3,17.91 33.65,17.91 33.05,18.51 U16.2 33.35,23.57 C74.2 C73.2 37.14,23.57 37.59,23.11 37.59,22.1 38.1,21.59 39.83,21.59 U1.28
$1N4726: length 2.1
  Top Layer w0.254: R19.2 10.48,44.22 LED5.2
$1N4727: length 2.1
  Top Layer w0.254: R17.2 10.48,40.66 LED4.2
$1N4730: length 2
  Top Layer w0.254: R18.2 10.48,37.61 LED6.2

## Copper pours and planes (outline as drawn; the poured copper is in the pictures)
3.3V on Top Layer: 16.19,19.94 17.12,19.94 17.12,15.92 16.19,15.92
3.3V on Top Layer: 12.38,16.77 17.12,16.77 17.12,15.92 12.38,15.92
3.3V on Top Layer: 16.23,19.94 22.88,19.94 22.88,17.93 16.23,17.93
3.3V on Inner2: 21.24,19.94 22.92,19.94 22.92,17.91 21.24,17.91
+5V on Top Layer: 88.17,35.77 90.71,35.77 90.71,25.69 88.17,25.69
+5V on Top Layer: 6.39,16.72 11.05,16.72 11.05,16.01 6.39,16.01
+5V on Top Layer: 5.78,21.47 7.66,21.47 7.66,15.92 5.78,15.92
+5V on Top Layer: 8.23,18.43 9.4,18.43 9.4,15.92 8.23,15.92
+5V on Top Layer: 5.78,28.45 7.69,28.45 7.69,21.33 5.78,21.33
+5V on Top Layer: 5.78,28.45 10.9,28.45 10.9,24.13 5.78,24.13
+5V on Inner2: 8.23,18.43 9.4,18.43 9.4,15.92 8.23,15.92
AGND on Top Layer: 38.1,53.72 41.4,53.72 41.4,28.57 38.1,28.57
AGND on Top Layer: 14.29,54.11 65.34,54.11 65.34,46.23 14.29,46.23
AGND on Top Layer: 31.5,26.03 38.23,26.03 38.23,24.38 31.5,24.38
AGND on Top Layer: 31.5,28.07 33.4,28.07 33.4,24.49 31.5,24.49
AGND on Top Layer: 24.96,36.83 31.75,36.83 31.75,35.05 24.96,35.05
AGND on Top Layer: 24.64,51.82 26.58,51.82 26.58,35.05 24.64,35.05
AGND on Top Layer: 29.97,36.45 31.88,36.45 31.88,24.56 29.97,24.56
AGND on Top Layer: -2.26,64.9 99.06,64.9 99.06,49.15 -2.26,49.15
AGND on Bottom Layer: -1.91,65.79 94.49,65.79 94.49,48.13 -1.91,48.13
AGND on Inner1: -6.73,65.28 96.77,65.28 96.77,49.12 -6.73,49.12
AGND on Inner1: 23.88,53.72 41.02,53.72 41.02,22.35 23.88,22.35
AGND on Inner1: 23.75,29.72 38.51,29.72 38.51,22.35 23.75,22.35
AGND on Inner1: 23.88,53.47 26.8,53.47 26.8,22.71 23.88,22.71
GND on Top Layer: -4.19,67.94 96.27,67.94 96.27,-2.67 -4.19,-2.67
GND on Bottom Layer: -2.29,49.02 96.52,49.02 96.52,-2.92 -2.29,-2.92
GND on Inner1: -4.19,69.72 95.89,69.72 95.89,-3.56 -4.19,-3.56
GND on Inner2: -4.19,69.43 97.41,69.43 97.41,-5.72 -4.19,-5.72

Small or netless copper shapes (teardrops, artwork), in the pictures only: 236 on Top Layer, 54 on Bottom Layer, 20 on Inner1, 44 on Inner2

## Text on the board
Bottom Silkscreen Layer: STM32G474RET6 | 2025/7/26
Top Silkscreen Layer: PB10 | +5v | 3.3v | GND | AGND | C2IN12 | C2IN3 | C2IN11 | KEY1 | C2IN4 | C2IN5 | C2IN9 | RST | C1IN3 | C1IN1 | C1IN2 | C1IN8 | C1IN7 | C1IN4 | C1IN6 | RX | TX | CHC1 | CHC2 | CHD1 | CHD2 | CHF1 | CHF2 | CHE1 | CHE2 | 5V | CLK | SWD | TIM3CH4 | TIM3CH3 | TIM2CH4 | TIM4CH2 | SCL | SDA | gnd | CHA1 | CHA2 | 3.3 | MOSI | MISO | SCK | USART1 | USART2 | CHB1 | CHB2
